# EAGLE design etrx357-redone (EAGLE 6.4)
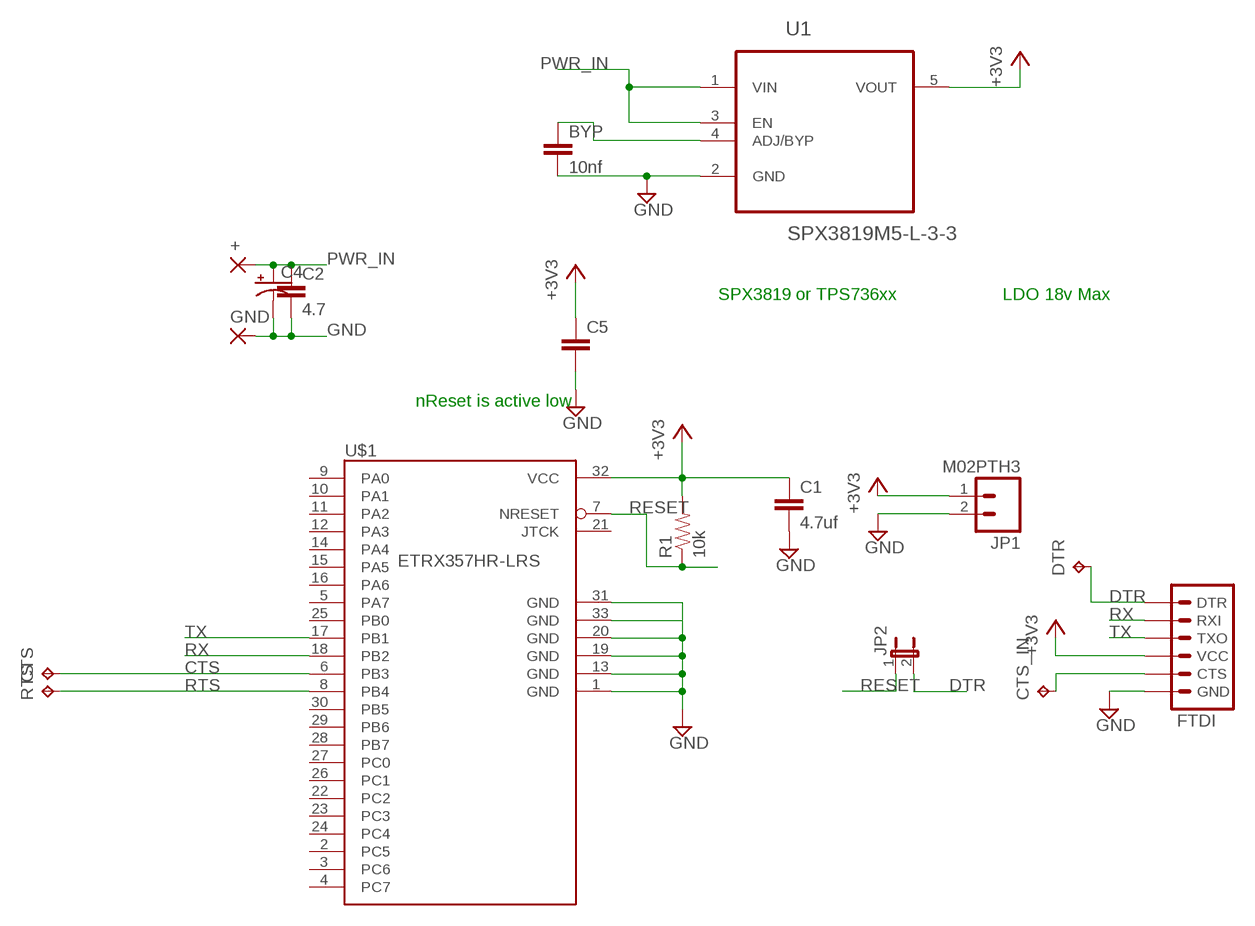
[diagram p0: schematic, sheet 1]

## Parts
+  3,17/1,3  [3,17/1,3]
BYP  10nf  CAP0603-CAP  [0603-CAP]
C1  4.7uf  CAP0603-CAP  [0603-CAP]
C2  4.7  CAP0603-CAP  [0603-CAP]
C4  CAP_POLPTH1  [CPOL-RADIAL-100UF-25V]
C5  CAPPTH  [CAP-PTH-SMALL]
CTS  TPTP20R  [TP20R]
CTS_IN  TPTP20R  [TP20R]
DTR  TPTP20R  [TP20R]
FTDI  ARDUINO_SERIAL_PROGRAMPTH  [1X06]
GND  3,17/1,3  [3,17/1,3]
JP1  M02PTH3  [1X02_LONGPADS]
JP2  JUMPER-2-OLDSMD-NO  [SJ_2S-NO]
R1  10k  RESISTOR0603-RES  [0603-RES]
RTS  TPTP20R  [TP20R]
U1  SPX3819M5-L-3-3  [SOT95P280X145-5N]
U$1  ETRX357HR-LRS  [ETRX3]

## Nets
+3V3 [power]: C1.1 C5.1 FTDI.4(VCC) JP1.1 R1.2 U1.5(VOUT) U$1.32(VCC)
CTS: CTS.TP U$1.6(PB3)
DTR: DTR.TP FTDI.1(DTR) JP2.2
GND [power]: BYP.2 C1.2 C2.2 C4.2(-) C5.2 FTDI.6(GND) GND.1(P) JP1.2 U1.2(GND) U$1.1(GND) U$1.13(GND) U$1.19(GND) U$1.20(GND) U$1.31(GND) U$1.33(GND)
N$1: CTS_IN.TP FTDI.5(CTS)
N$3: BYP.1 U1.4(ADJ/BYP)
PWR_IN [power]: +.1(P) C2.1 C4.1(+) U1.1(VIN) U1.3(EN)
RESET: JP2.1 R1.1 U$1.7(NRESET)
RTS: RTS.TP U$1.8(PB4)
RX: FTDI.2(RXI) U$1.18(PB2)
TX: FTDI.3(TXO) U$1.17(PB1)
Unconnected: U$1.2(PC5) U$1.3(PC6) U$1.4(PC7) U$1.5(PA7) U$1.9(PA0) U$1.10(PA1) U$1.11(PA2) U$1.12(PA3) U$1.14(PA4) U$1.15(PA5) U$1.16(PA6) U$1.21(JTCK) U$1.22(PC2) U$1.23(PC3) U$1.24(PC4) U$1.25(PB0) U$1.26(PC1) U$1.27(PC0) U$1.28(PB7) U$1.29(PB6) U$1.30(PB5)

## Notes on the sheet
- SPX3819 or TPS736xx | LDO 18v Max
- nReset is active low

## Library data of the parts
+ GND = wirepad:3,17/1,3: THROUGH-HOLE PAD
BYP C1 C2 C5 = SparkFun-Capacitors:CAP: Capacitor Standard 0603 ceramic capacitor, and 0.1" leaded capacitor.
C4 = SparkFun-Passives:CAP_POL: Capacitor Polarized These are standard SMD and PTH capacitors. Normally 10uF, 47uF, and 100uF in electrolytic and tantalum varieties. Always verify the external diameter of the through hole cap, it varies with capacity, voltage, and manufacturer. The EIA devices should be standard.
CTS CTS_IN DTR RTS = testpad:TP: Test pad
FTDI = SparkFun-Connectors:ARDUINO_SERIAL_PROGRAM: FTDI connector footprints
JP1 = SparkFun-Connectors:M02: Standard 2-pin 0.1" header. Use with - straight break away headers ( PRT-00116) - right angle break away headers (PRT-00553) - swiss pins (PRT-00743) - machine pins (PRT-00117) - female headers (PRT-00115) Molex polarized connector foot print use with: PRT-08233 with associated crimp pins and housings. 2.54_SCREWTERM for use with PRT-10571. 3.5mm Screw Terminal footprints for PRT-08084 5mm Screw Terminal footprints for use with PRT-08433
JP2 = SparkFun-Passives:JUMPER-2-OLD: Jumper Basic 0.1" spaced jumper. Use with breakaway headers.
R1 = SparkFun-Passives:RESISTOR: Resistor Basic schematic elements and footprints for 0603, 1206, and PTH resistors.
U1 = James:SPX3819M5-L-3-3: 500mA, LOW-NOISE LDO VOLTAGE REGULATOR; MPN: SPX3819M5-L-3-3; OC_FARNELL: 1831949; OC_NEWARK: 23R9702; PACKAGE: SOT-23-5; SUPPLIER: EXAR
U$1 = ETRX357_logical:ETRX357*: ETRX357 or ETRX351. Pins arranged logically

## Net classes
0 default: width 0.254 mm, clearance 0.102 mm
1 power: width 0.508 mm

## Board
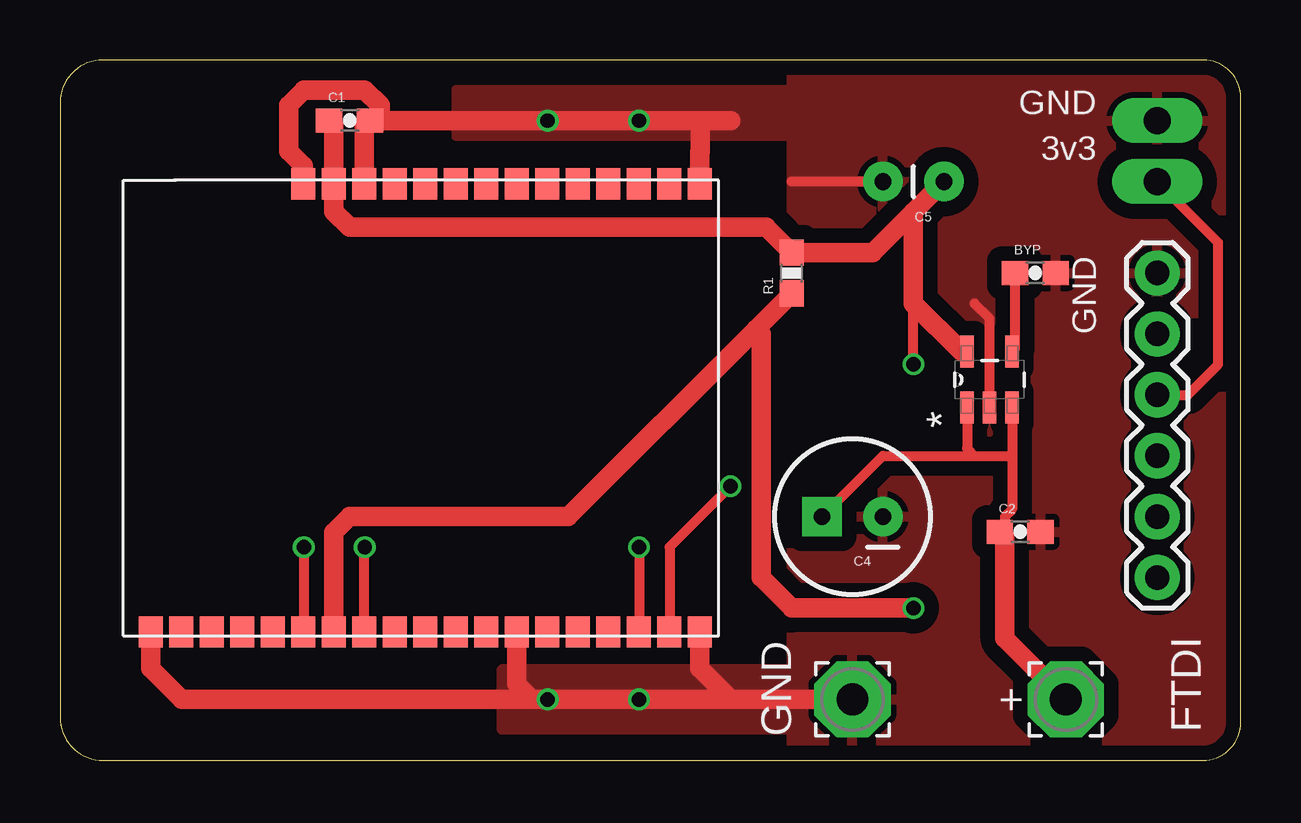
[diagram p1: board, top side]
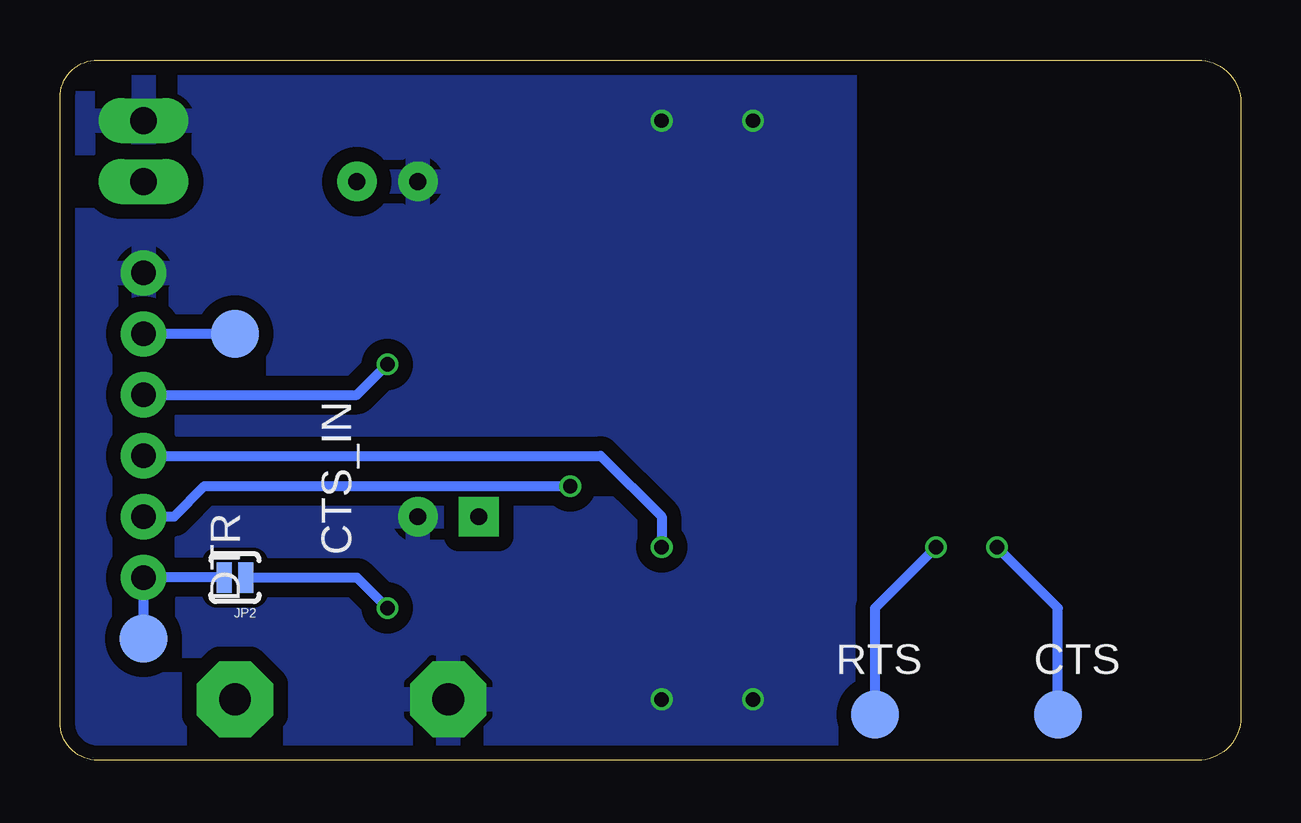
[diagram p2: board, bottom side, seen from below]

Size 49.2 x 29.2 mm. Coordinates in mm from the lower left corner, seen from the top.
Outline: 0,27.41 0,1.8 arc90 1.8,0 47.62,0 arc90 49.2,1.58 49.2,27.63 arc90 47.63,29.2 1.79,29.2 arc90 0,27.41
Copper layers (1*16): Top 0.035mm / dielectric 1.5mm / Bottom 0.035mm
Design rules "dirt_cheap_dirty_boards.v1": minimum track width 5mil, minimum drill 12mil, track to track 5mil, track to pad 5mil, pad to pad 5mil, via to via 5mil, smd to smd 0mil, copper to edge 10mil, drill to drill 10mil, minimum pad ring 10mil, minimum via ring 6mil, stop-mask expansion 2mil, vias tented up to drill 25mil, thermal gap 10mil

### Footprints (pad centres in the part's own frame; a part is rotated, then mirrored left to right if it is on the bottom)
3,17/1,3 = drill 1.321 pad 3.175 octagon: 1 0,0
0603-CAP = smd 1.1 x 1: 1 -0.85,0; 2 0.85,0
CPOL-RADIAL-100UF-25V = drill 0.7 pad 1.651 square: 1 1.27,0 | drill 0.7 pad 1.651: 2 -1.27,0
CAP-PTH-SMALL = drill 0.7 pad 1.651: 1 0,0; 2 2.54,0
TP20R = smd 2 x 2: TP 0,0
1X06 = drill 1.016 pad 1.88: 1 0,0; 2 2.54,0; 3 5.08,0; 4 7.62,0; 5 10.16,0; 6 12.7,0
1X02_LONGPADS = drill 1.118 pad 1.88 long: 1 0,0; 2 2.54,0
SJ_2S-NO = smd 0.635 x 1.27: 1 -0.45,0; 2 0.45,0
0603-RES = smd 1.1 x 1: 1 -0.85,0; 2 0.85,0
SOT95P280X145-5N = smd 1.321 x 0.559: 1 -1.168,0.94; 2 -1.168,0; 3 -1.168,-0.94; 4 1.168,-0.94; 5 1.168,0.94
ETRX3 = smd 1 x 1.3: 1 1.25,0.28; 2 2.52,0.28; 3 3.79,0.28; 4 5.06,0.28; 5 6.33,0.28; 6 7.6,0.28; 7 8.87,0.28; 8 10.14,0.28; 9 11.41,0.28; 10 12.68,0.28; 11 13.95,0.28; 12 15.22,0.28; 13 16.49,0.28; 14 17.76,0.28; 15 19.03,0.28; 16 20.3,0.28; 17 21.57,0.28; 18 22.84,0.28; 19 24.11,0.28; 20 24.11,18.95; 21 22.84,18.95; 22 21.57,18.95; 23 20.3,18.95; 24 19.03,18.95; 25 17.76,18.95; 26 16.49,18.95; 27 15.22,18.95; 28 13.95,18.95; 29 12.68,18.95; 30 11.41,18.95; 31 10.14,18.95; 32 8.87,18.95; 33 7.6,18.95

### Placement (x,y rotation side)
+  41.91,2.54 0 top
BYP  40.64,20.32 0 top
C1  12.06,26.67 0 top
C2  40.01,9.53 0 top
C4  33.02,10.16 180 top
C5  36.83,24.13 180 top
CTS  7.62,1.91 0 bottom
CTS_IN  41.91,17.78 0 bottom
DTR  45.72,5.08 90 bottom
FTDI  45.72,7.62 90 top
GND  33.02,2.54 0 top
JP1  45.72,24.13 90 top
JP2  41.91,7.62 180 bottom
R1  30.48,20.32 90 top
RTS  15.24,1.91 0 bottom
U1  38.73,15.88 90 top
U$1  2.54,5.08 0 top

### Tracks (layer width: path | path; a pad name or v marks a point on that pad's centre or on a via)
+3V3  (via drill 0.6)
  Top 0.406: U1.5 37.57,17.04 | v35.56,16.51 35.56,19.05 | FTDI.4 46.99,15.24 48.26,16.51 48.26,21.59 JP1.1
  Top 0.813: 37.57,17.04 35.56,19.05 35.56,22.86 | 35.56,22.86 C5.1 | 35.56,22.86 33.87,21.17 R1.2 29.43,22.23 12.06,22.23 11.41,22.88 U$1.32 11.41,26.48 C1.1
  Bottom 0.406: FTDI.4 36.83,15.24 v35.56,16.51
CTS  (via drill 0.6)
  Top 0.406: v10.16,8.89 10.16,5.38 U$1.6
  Bottom 0.406: CTS.TP 7.62,6.35 v10.16,8.89
DTR
  Bottom 0.406: JP2.2 FTDI.1 DTR.TP
GND  (via drill 0.6)
  Top 0.406: U1.2 38.73,18.41 38.1,19.05 | 12.68,26.43 C1.2 13.34,27.09 | 12.7,24.01 U$1.31 | C5.2 30.48,24.13 | U$1.33 10.14,24.79
  Top 0.813: U$1.31 12.68,26.43 | 27.94,26.67 26.67,26.67 | 26.67,26.67 C1.2 | U$1.20 26.65,25.38 26.67,25.38 26.67,26.67 | 10.14,24.79 9.53,25.4 9.53,27.3 10.16,27.94 12.7,27.94 13.34,27.3 13.34,27.09 | U$1.13 19.03,3.19 19.68,2.54 | 19.68,2.54 v20.32,2.54 v24.13,2.54 27.94,2.54 | 27.94,2.54 GND.1 | U$1.19 26.65,3.83 27.94,2.54 | U$1.1 3.79,3.83 5.08,2.54 19.68,2.54
  other vias: 20.32,26.67 24.13,26.67
  pour Bottom (isolate 0.61): 16.51,29.21 48.26,29.21 48.26,0 16.51,0
  pour Top (isolate 0.61): 30.48,29.21 49.53,29.21 49.53,0 30.48,0
  pour Top: 18.41,3.81 30.48,3.81 30.48,1.27 18.41,1.27
  pour Top: 30.48,27.94 16.51,27.94 16.51,26.67 16.51,26.04 30.48,26.04
N$1
  Bottom 0.406: CTS_IN.TP FTDI.5
N$3
  Top 0.406: BYP.1 39.79,17.16 U1.4
PWR_IN
  Top 0.406: U1.3 39.67,12.7 | 39.67,12.7 39.67,10.46 39.37,10.16 39.37,9.74 C2.1 | C4.1 34.29,12.7 38.1,12.7 | 38.1,12.7 39.67,12.7 | U1.1 37.8,13.01 38.1,12.7
  Top 0.813: +.1 39.37,5.08 39.37,9.31 C2.1
RESET  (via drill 0.6)
  Top 0.406: 29.21,17.78 29,17.99
  Top 0.813: U$1.7 11.41,9.51 12.06,10.16 21.17,10.16 29,17.99 R1.1 | v35.56,6.35 30.48,6.35 29.21,7.62 29.21,17.78
  Bottom 0.406: JP2.1 36.83,7.62 v35.56,6.35
RTS  (via drill 0.6)
  Top 0.406: U$1.8 12.68,8.87 v12.7,8.89
  Bottom 0.406: RTS.TP 15.24,6.35 13.34,8.26 v12.7,8.89
RX  (via drill 0.6)
  Top 0.406: U$1.18 25.4,5.38 25.4,8.89 v27.94,11.43
  Bottom 0.406: FTDI.2 44.45,10.16 43.18,11.43 v27.94,11.43
TX  (via drill 0.6)
  Top 0.406: v24.13,8.89 24.13,5.38 U$1.17
  Bottom 0.406: FTDI.3 26.67,12.7 24.13,10.16 v24.13,8.89

### Text on the board
tNames: GND | 3v3 | GND